# EAGLE schematic KVR LABS - AEV ENCODER 1.01-STM32 (EAGLE 9.6.1)

## Sheet 1 of 9: STM32F413RGT6
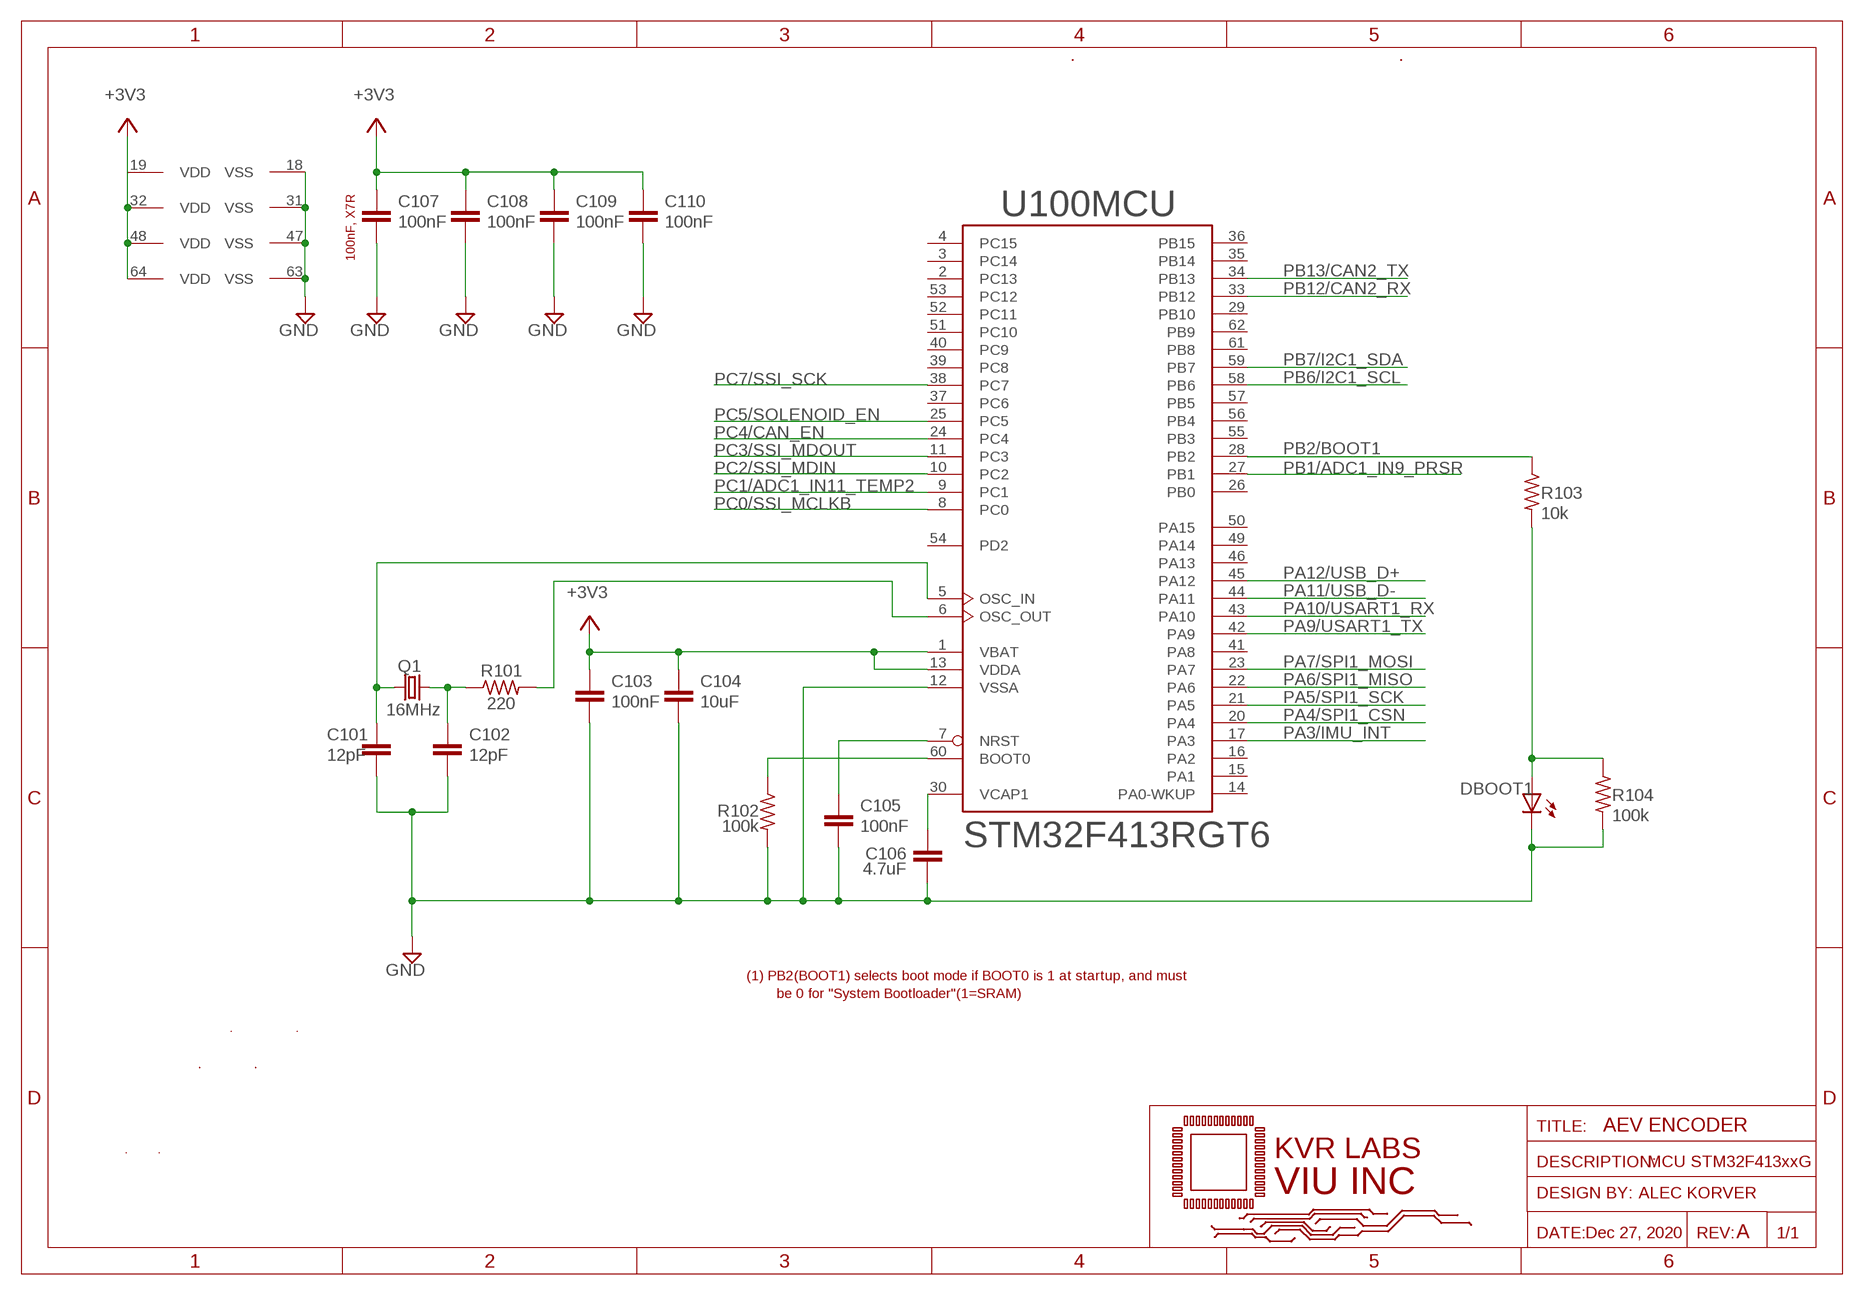
[diagram p0: schematic, sheet 1]

### Parts
C101  12pF  C-EUC0603  [C0603]
C102  12pF  C-EUC0603  [C0603]
C103  100nF  C-EUC0603  [C0603]
C104  10uF  C-EUC0603  [C0603]
C105  100nF  C-EUC0603  [C0603]
C106  4.7uF  C-EUC0603  [C0603]
C107  100nF  C-EUC0603  [C0603]
C108  100nF  C-EUC0603  [C0603]
C109  100nF  C-EUC0603  [C0603]
C110  100nF  C-EUC0603  [C0603]
DBOOT1  LEDCHIPLED_0805  [CHIPLED_0805]
Q1  16MHz  CRYTALS32  [CRY3225-4]
R101  220  R-US_R0603  [R0603]
R102  100k  R-US_R0603  [R0603]
R103  10k  R-US_R0603  [R0603]
R104  100k  R-US_R0603  [R0603]
U100  STM32F413RGT6  STM32F401RBT  [LQFP64_STMLIB]

### Nets
+3V3: C103.1 C104.1 C107.1 C108.1 C109.1 C110.1 U100.1(MCU:VBAT) U100.13(MCU:VDDA) U100.19(PWR:VDD) U100.32(PWR:VDD) U100.48(PWR:VDD) U100.64(PWR:VDD) ; also sheet 2,4,5,6,7,8
BOOT0: R102.1 U100.60(MCU:BOOT0) ; also sheet 7
GND: C101.2 C102.2 C103.2 C104.2 C105.2 C106.2 C107.2 C108.2 C109.2 C110.2 DBOOT1.C R102.2 R104.2 U100.12(MCU:VSSA) U100.18(PWR:VSS) U100.31(PWR:VSS) U100.47(PWR:VSS) U100.63(PWR:VSS) ; also sheet 2,4,5,6,7,8,9
N$43: DBOOT1.A R103.2 R104.1
N$44: R101.2 U100.6(MCU:OSC_OUT)
NRST: C105.1 U100.7(MCU:NRST)
OSC_IN: C101.1 Q1.3 U100.5(MCU:OSC_IN)
OSC_OUT: C102.1 Q1.1 R101.1
PA3/IMU_INT: U100.17(MCU:PA3) ; also sheet 5
PA4/SPI1_CSN: U100.20(MCU:PA4) ; also sheet 5
PA5/SPI1_SCK: U100.21(MCU:PA5) ; also sheet 5
PA6/SPI1_MISO: U100.22(MCU:PA6) ; also sheet 5
PA7/SPI1_MOSI: U100.23(MCU:PA7) ; also sheet 5
PA9/USART1_TX: U100.42(MCU:PA9) ; also sheet 7
PA10/USART1_RX: U100.43(MCU:PA10) ; also sheet 7
PA11/USB_D- [power]: U100.44(MCU:PA11) ; also sheet 7
PA12/USB_D+ [power]: U100.45(MCU:PA12) ; also sheet 7
PB1/ADC1_IN9_PRSR: U100.27(MCU:PB1) ; also sheet 7
PB2/BOOT1: R103.1 U100.28(MCU:PB2) ; also sheet 7
PB6/I2C1_SCL: U100.58(MCU:PB6)
PB7/I2C1_SDA: U100.59(MCU:PB7)
PB12/CAN2_RX: U100.33(MCU:PB12) ; also sheet 2
PB13/CAN2_TX: U100.34(MCU:PB13) ; also sheet 2
PC0/SSI_MCLKB: U100.8(MCU:PC0) ; also sheet 4
PC1/ADC1_IN11_TEMP2: U100.9(MCU:PC1) ; also sheet 8
PC2/SSI_MDIN: U100.10(MCU:PC2) ; also sheet 4
PC3/SSI_MDOUT: U100.11(MCU:PC3) ; also sheet 4
PC4/CAN_EN: U100.24(MCU:PC4) ; also sheet 2
PC5/SOLENOID_EN: U100.25(MCU:PC5) ; also sheet 9
PC7/SSI_SCK: U100.38(MCU:PC7) ; also sheet 4
VCAP: C106.1 U100.30(MCU:VCAP1)
Unconnected: U100.2(MCU:PC13) U100.3(MCU:PC14) U100.4(MCU:PC15) U100.14(MCU:PA0-WKUP) U100.15(MCU:PA1) U100.16(MCU:PA2) U100.26(MCU:PB0) U100.29(MCU:PB10) U100.35(MCU:PB14) U100.36(MCU:PB15) U100.37(MCU:PC6) U100.39(MCU:PC8) U100.40(MCU:PC9) U100.41(MCU:PA8) U100.46(MCU:PA13) U100.49(MCU:PA14) U100.50(MCU:PA15) U100.51(MCU:PC10) U100.52(MCU:PC11) U100.53(MCU:PC12) U100.54(MCU:PD2) U100.55(MCU:PB3) U100.56(MCU:PB4) U100.57(MCU:PB5) U100.61(MCU:PB8) U100.62(MCU:PB9)

### Notes on the sheet
- 100nF, X7R
- (1) PB2(BOOT1) selects boot mode if BOOT0 is 1 at startup, and must
- be 0 for "System Bootloader"(1=SRAM)
- AEV ENCODER
- MCU STM32F413xxG
- Dec 27, 2020 | A

## Sheet 2 of 9: CANbus
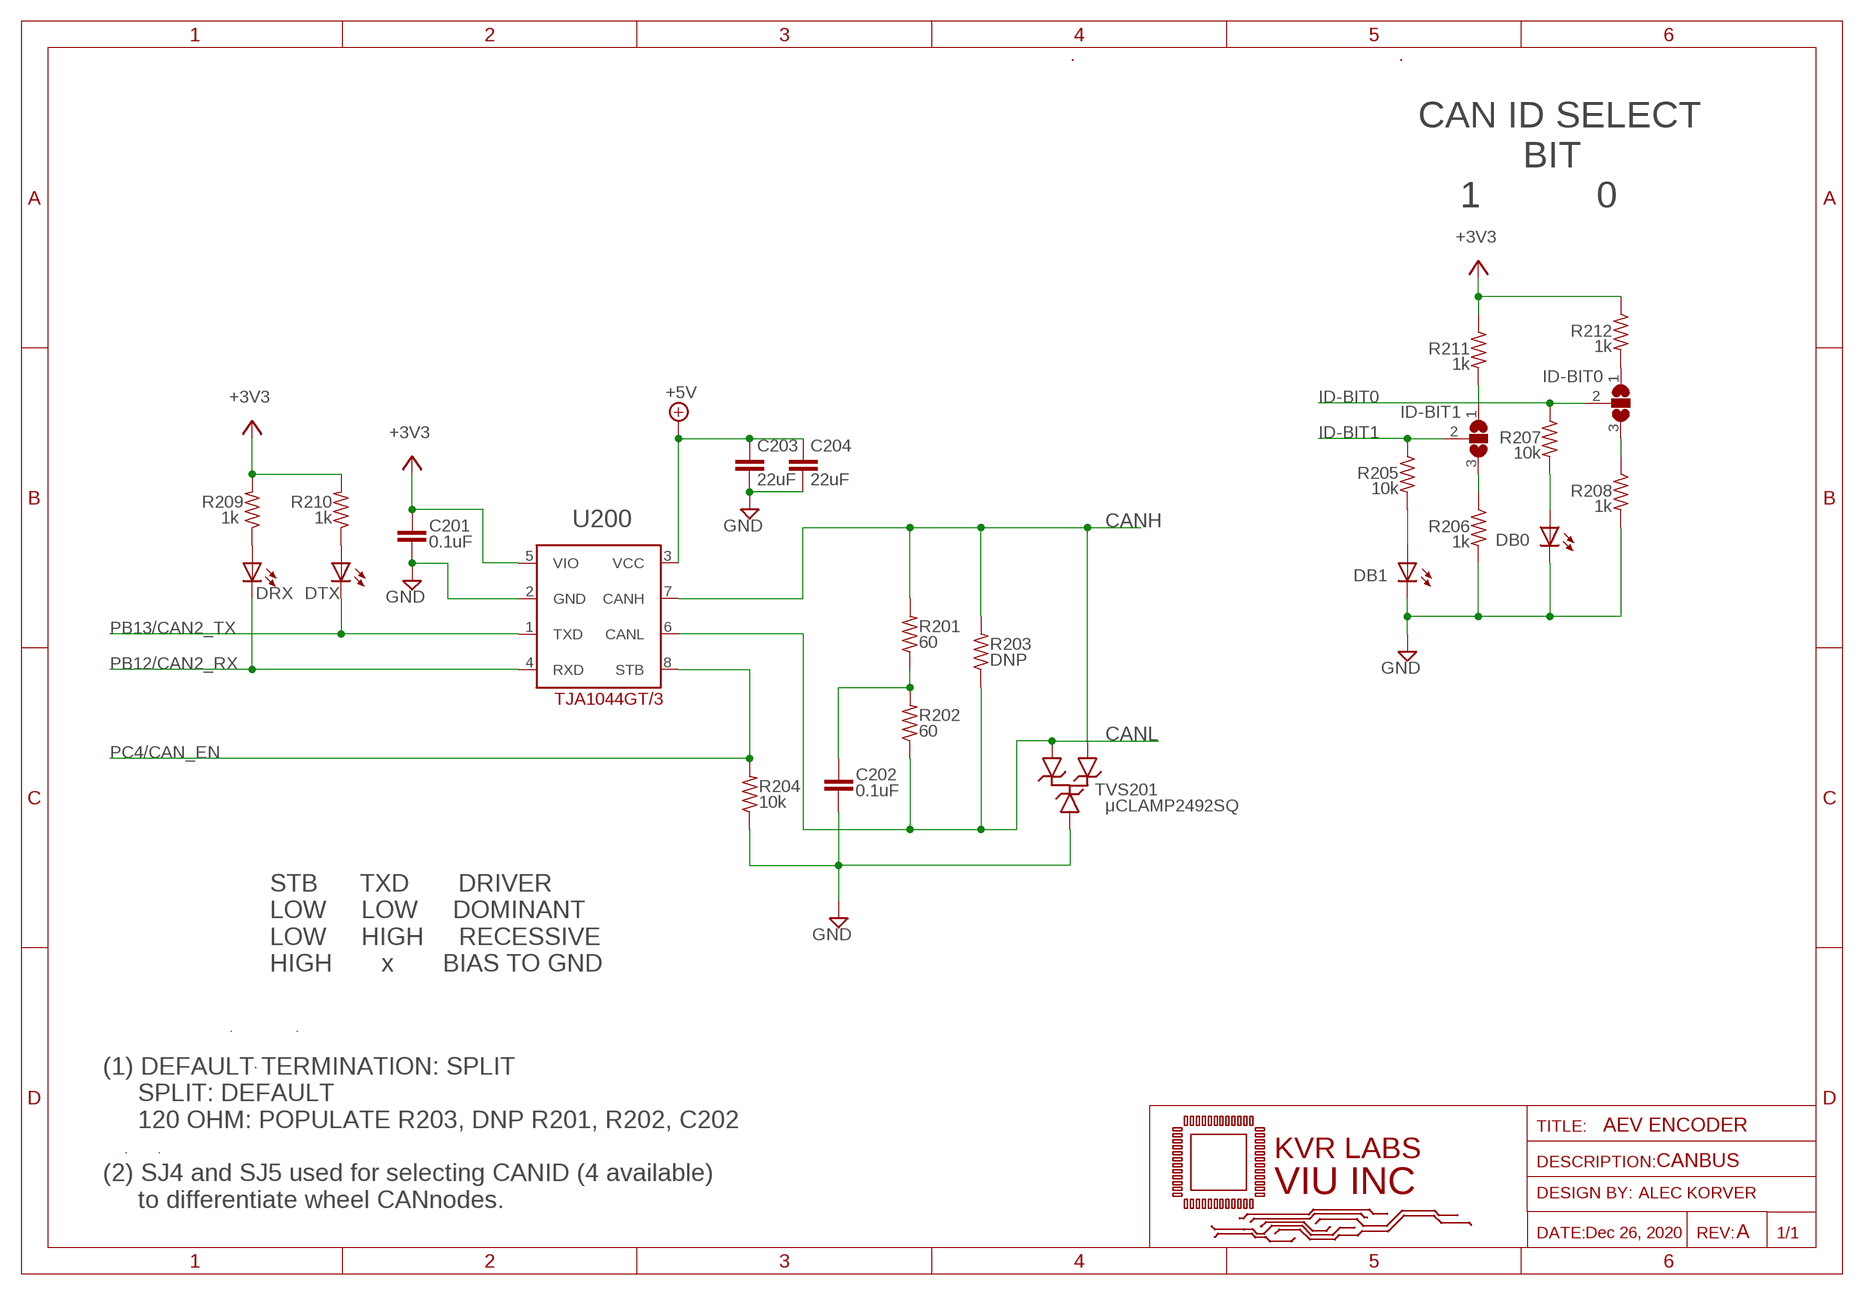
[diagram p1: schematic, sheet 2]

### Parts
C201  0.1uF  C-EUC0603  [C0603]
C202  0.1uF  C-EUC0603  [C0603]
C203  22uF  C-EUC1206  [C1206]
C204  22uF  C-EUC1206  [C1206]
D201  μCLAMP2492SQ  [SOT-23_3L_ONS]
DB0  LEDCHIPLED_0805  [CHIPLED_0805]
DB1  LEDCHIPLED_0805  [CHIPLED_0805]
DRX  LEDCHIPLED_0805  [CHIPLED_0805]
DTX  LEDCHIPLED_0805  [CHIPLED_0805]
ID-BIT0  SJ2W  [SJ_2]
ID-BIT1  SJ2W  [SJ_2]
R201  60  R-US_R0603  [R0603]
R202  60  R-US_R0603  [R0603]
R203  DNP  R-US_R0603  [R0603]
R204  10k  R-US_R0603  [R0603]
R205  10k  R-US_R0603  [R0603]
R206  1k  R-US_R0603  [R0603]
R207  10k  R-US_R0603  [R0603]
R208  1k  R-US_R0603  [R0603]
R209  1k  R-US_R0603  [R0603]
R210  1k  R-US_R0603  [R0603]
R211  1k  R-US_R0603  [R0603]
R212  1k  R-US_R0603  [R0603]
U200  TJA1044GT/3  [SO-8_S_LIT]

### Nets
+3V3: C201.1 R209.2 R210.2 R211.1 R212.1 U200.5(VIO) ; also sheet 1,4,5,6,7,8
+5V: C203.1 C204.1 U200.3(VCC) ; also sheet 6
CANH: D201.2 R201.2 R203.2 U200.7(CANH) ; also sheet 7
CANL: D201.1 R202.1 R203.1 U200.6(CANL) ; also sheet 7
GND: C201.2 C202.2 C203.2 C204.2 D201.3 DB0.C DB1.C R204.1 R206.2 R208.2 U200.2(GND) ; also sheet 1,4,5,6,7,8,9
ID-BIT0: ID-BIT0.2 R207.1
ID-BIT1: ID-BIT1.2 R205.1
N$4: ID-BIT1.3 R206.1
N$6: ID-BIT0.3 R208.1
N$9: DB0.A R207.2
N$10: DB1.A R205.2
N$14: ID-BIT1.1 R211.2
N$15: ID-BIT0.1 R212.2
N$26: DRX.A R209.1
N$27: DTX.A R210.1
PB12/CAN2_RX: DRX.C U200.4(RXD) ; also sheet 1
PB13/CAN2_TX: DTX.C U200.1(TXD) ; also sheet 1
PC4/CAN_EN: R204.2 U200.8(STB) ; also sheet 1
SPLIT: C202.1 R201.1 R202.2

### Notes on the sheet
- CAN ID SELECT
             BIT
       1           0
- U200
- TVS201
- STB      TXD       DRIVER
  LOW     LOW     DOMINANT
  LOW     HIGH     RECESSIVE
  HIGH       x       BIAS TO GND
- AEV ENCODER
- CANBUS
- (1) DEFAULT TERMINATION: SPLIT
       SPLIT: DEFAULT 
       120 OHM: POPULATE R203, DNP R201, R202, C202
  
  (2) SJ4 and SJ5 used for selecting CANID (4 available) 
       to differentiate wheel CANnodes.
- Dec 26, 2020 | A

## Sheet 3 of 9: ABSOLUTE ENCODER
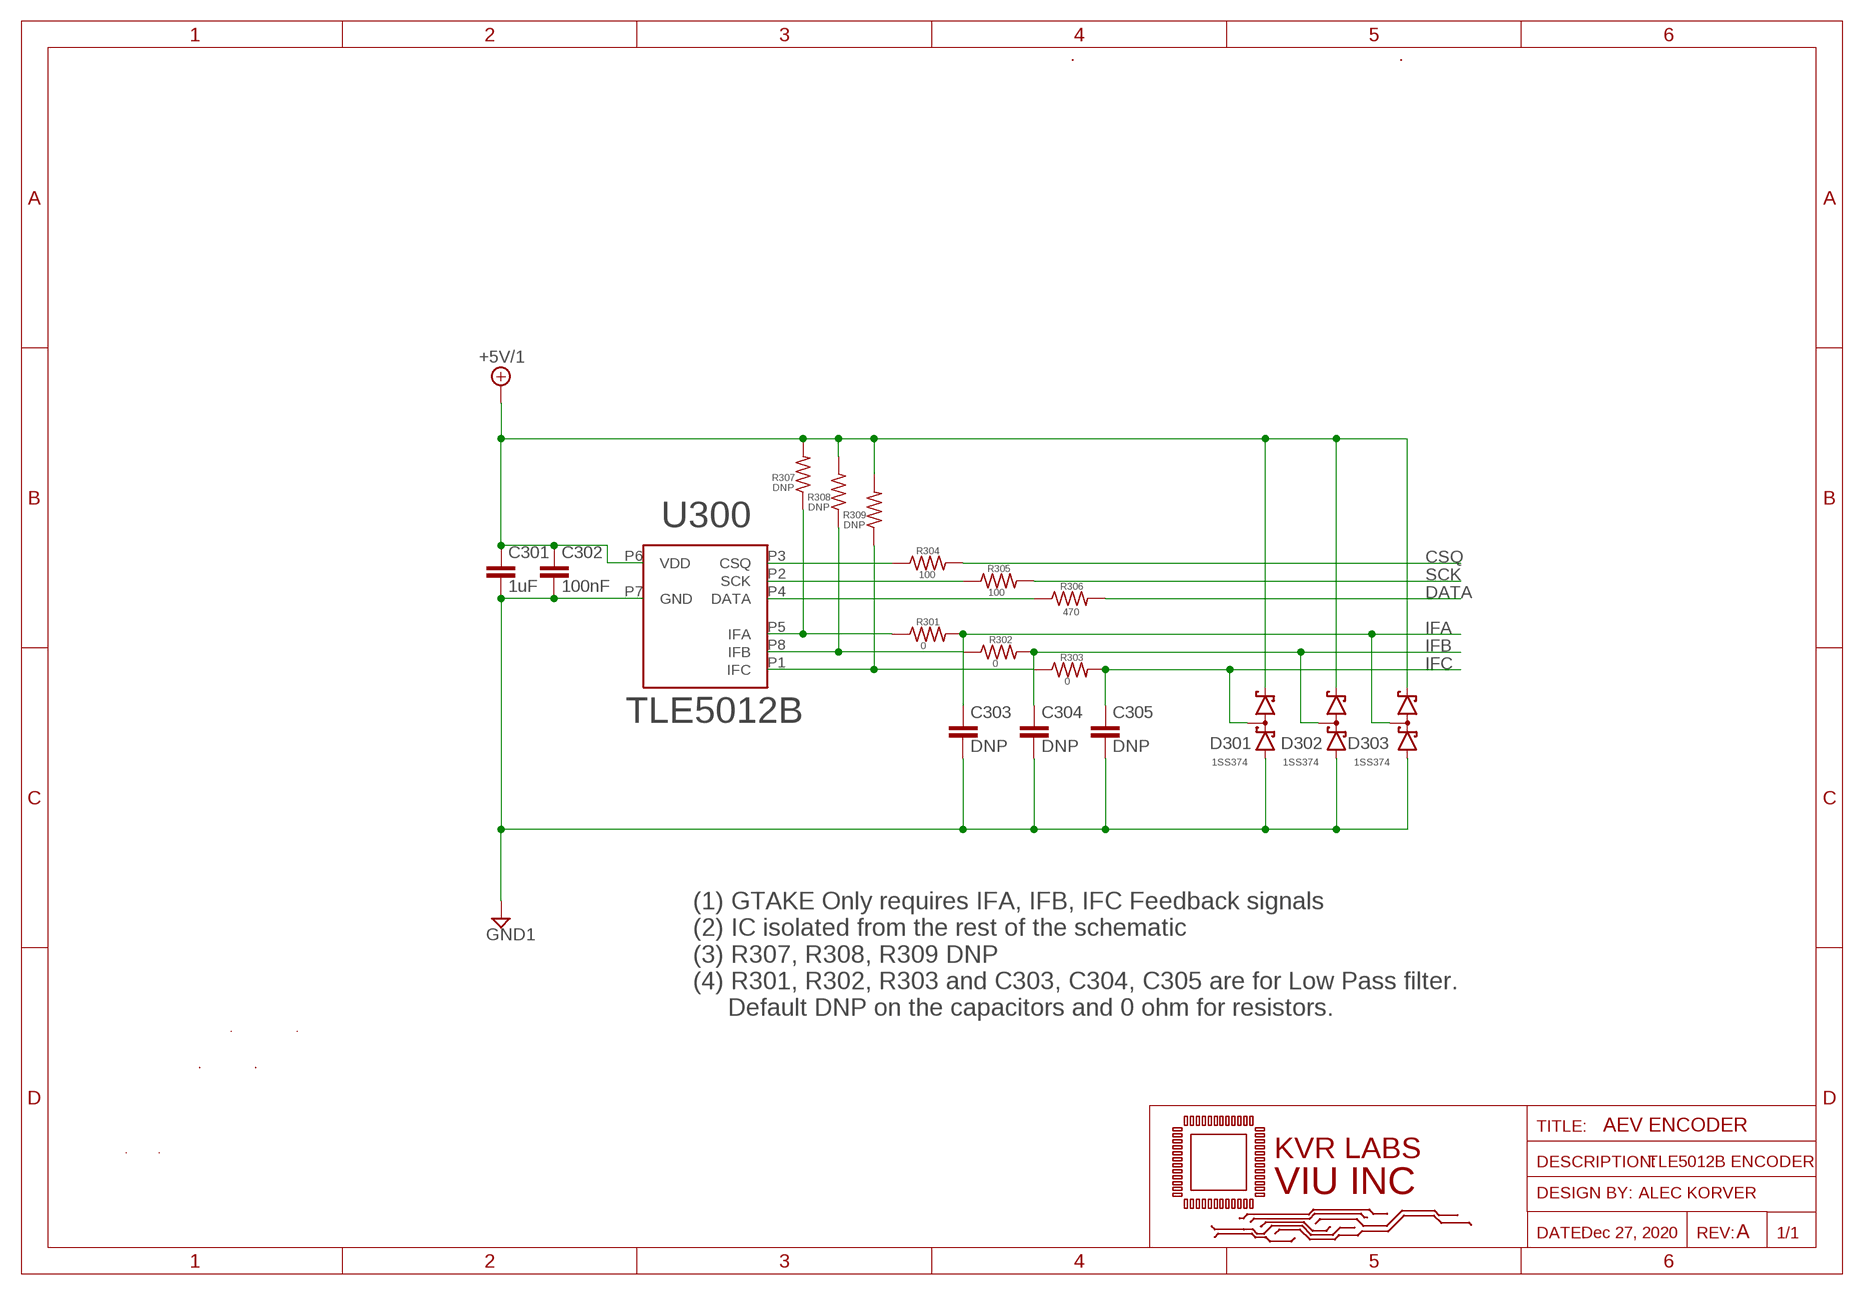
[diagram p2: schematic, sheet 3]

### Parts
C301  1uF  C-EUC0603  [C0603]
C302  100nF  C-EUC0603  [C0603]
C303  DNP  C-EUC0603  [C0603]
C304  DNP  C-EUC0603  [C0603]
C305  DNP  C-EUC0603  [C0603]
D301  BAS70-04  [SOT23]
D302  BAS70-04  [SOT23]
D303  BAS70-04  [SOT23]
R301  0  R-US_R0603  [R0603]
R302  0  R-US_R0603  [R0603]
R303  0  R-US_R0603  [R0603]
R304  100  R-US_R0603  [R0603]
R305  100  R-US_R0603  [R0603]
R306  470  R-US_R0603  [R0603]
R307  DNP  R-US_R0603  [R0603]
R308  DNP  R-US_R0603  [R0603]
R309  DNP  R-US_R0603  [R0603]
U300  TLE5012B  [PG-DSO-8]

### Nets
+5V/1: C301.1 C302.1 D301.2(C2) D302.2(C2) D303.2(C2) R307.2 R308.2 R309.2 U300.P6(VDD) ; also sheet 7
CSQ: R304.2 ; also sheet 7
DATA: R306.2 ; also sheet 7
GND1: C301.2 C302.2 C303.2 C304.2 C305.2 D301.1(A1) D302.1(A1) D303.1(A1) U300.P7(GND) ; also sheet 7
IFA: C303.1 D303.3(C1A2) R301.2 ; also sheet 7
IFB: C304.1 D302.3(C1A2) R302.2 ; also sheet 7
IFC: C305.1 D301.3(C1A2) R303.2 ; also sheet 7
N$35: R304.1 U300.P3(CSQ)
N$36: R305.1 U300.P2(SCK)
N$37: R306.1 U300.P4(DATA)
N$38: R301.1 R307.1 U300.P5(IFA)
N$39: R302.1 R308.1 U300.P8(IFB)
N$40: R303.1 R309.1 U300.P1(IFC)
SCK: R305.2 ; also sheet 7

### Notes on the sheet
- U300
- (1) GTAKE Only requires IFA, IFB, IFC Feedback signals
  (2) IC isolated from the rest of the schematic
  (3) R307, R308, R309 DNP 
  (4) R301, R302, R303 and C303, C304, C305 are for Low Pass filter. 
       Default DNP on the capacitors and 0 ohm for resistors.
- AEV ENCODER
- TLE5012B ENCODER
- Dec 27, 2020 | A

## Sheet 4 of 9: PRESSURE SENSOR
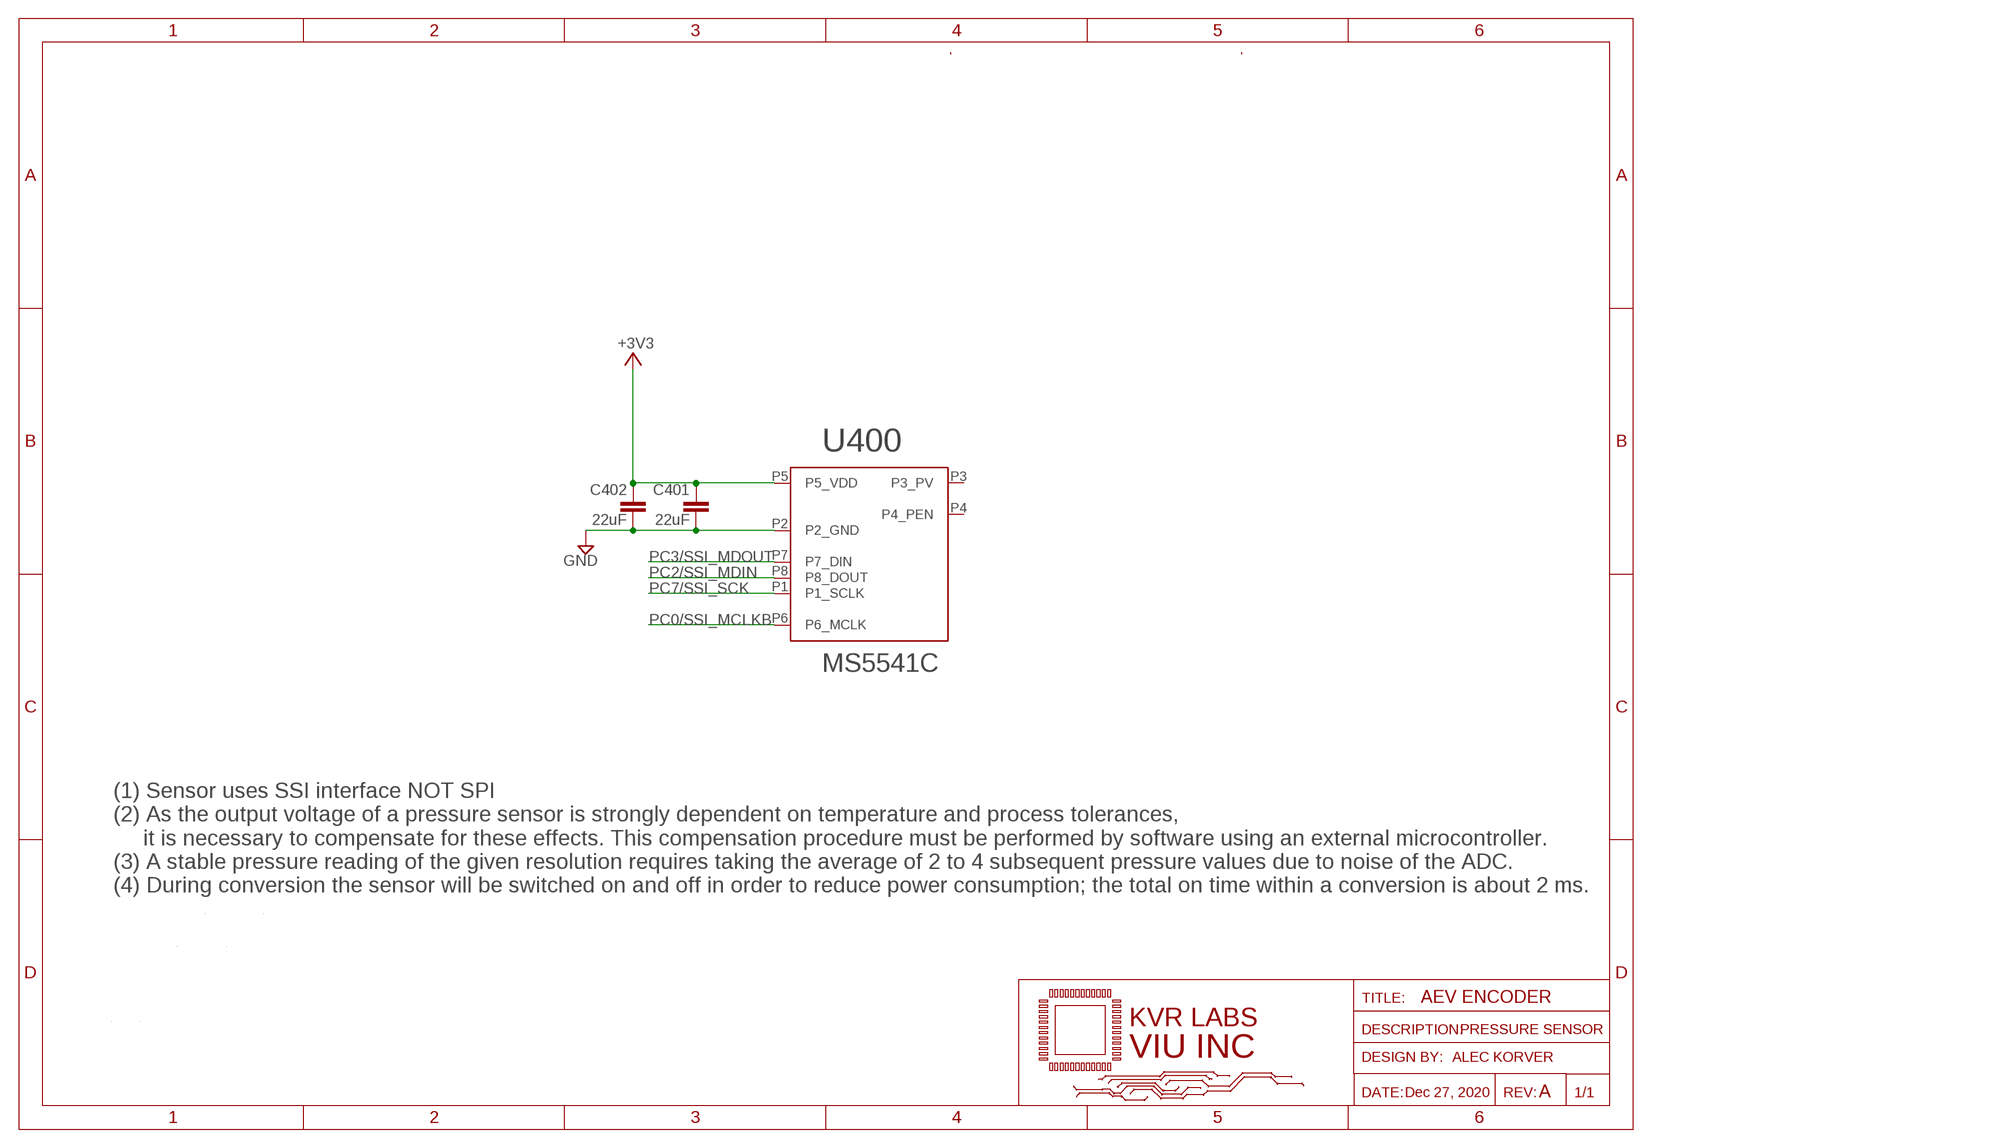
[diagram p3: schematic, sheet 4]

### Parts
C401  22uF  C-EUC1206  [C1206]
C402  22uF  C-EUC1206  [C1206]
U400  MS5541C  [MS5541C]

### Nets
+3V3: C401.1 C402.1 U400.P5(P5_VDD) ; also sheet 1,2,5,6,7,8
GND: C401.2 C402.2 U400.P2(P2_GND) ; also sheet 1,2,5,6,7,8,9
PC0/SSI_MCLKB: U400.P6(P6_MCLK) ; also sheet 1
PC2/SSI_MDIN: U400.P8(P8_DOUT) ; also sheet 1
PC3/SSI_MDOUT: U400.P7(P7_DIN) ; also sheet 1
PC7/SSI_SCK: U400.P1(P1_SCLK) ; also sheet 1
Unconnected: U400.P3(P3_PV) U400.P4(P4_PEN)

### Notes on the sheet
- (1) Sensor uses SSI interface NOT SPI
  (2) As the output voltage of a pressure sensor is strongly dependent on temperature and process tolerances, 
       it is necessary to compensate for these effects. This compensation procedure must be performed by software using an external microcontroller. 
  (3) A stable pressure reading of the given resolution requires taking the average of 2 to 4 subsequent pressure values due to noise of the ADC. 
  (4) During conversion the sensor will be switched on and off in order to reduce power consumption; the total on time within a conversion is about 2 ms.
- AEV ENCODER
- PRESSURE SENSOR
- Dec 27, 2020 | A

## Sheet 5 of 9: IMU - ICM20648
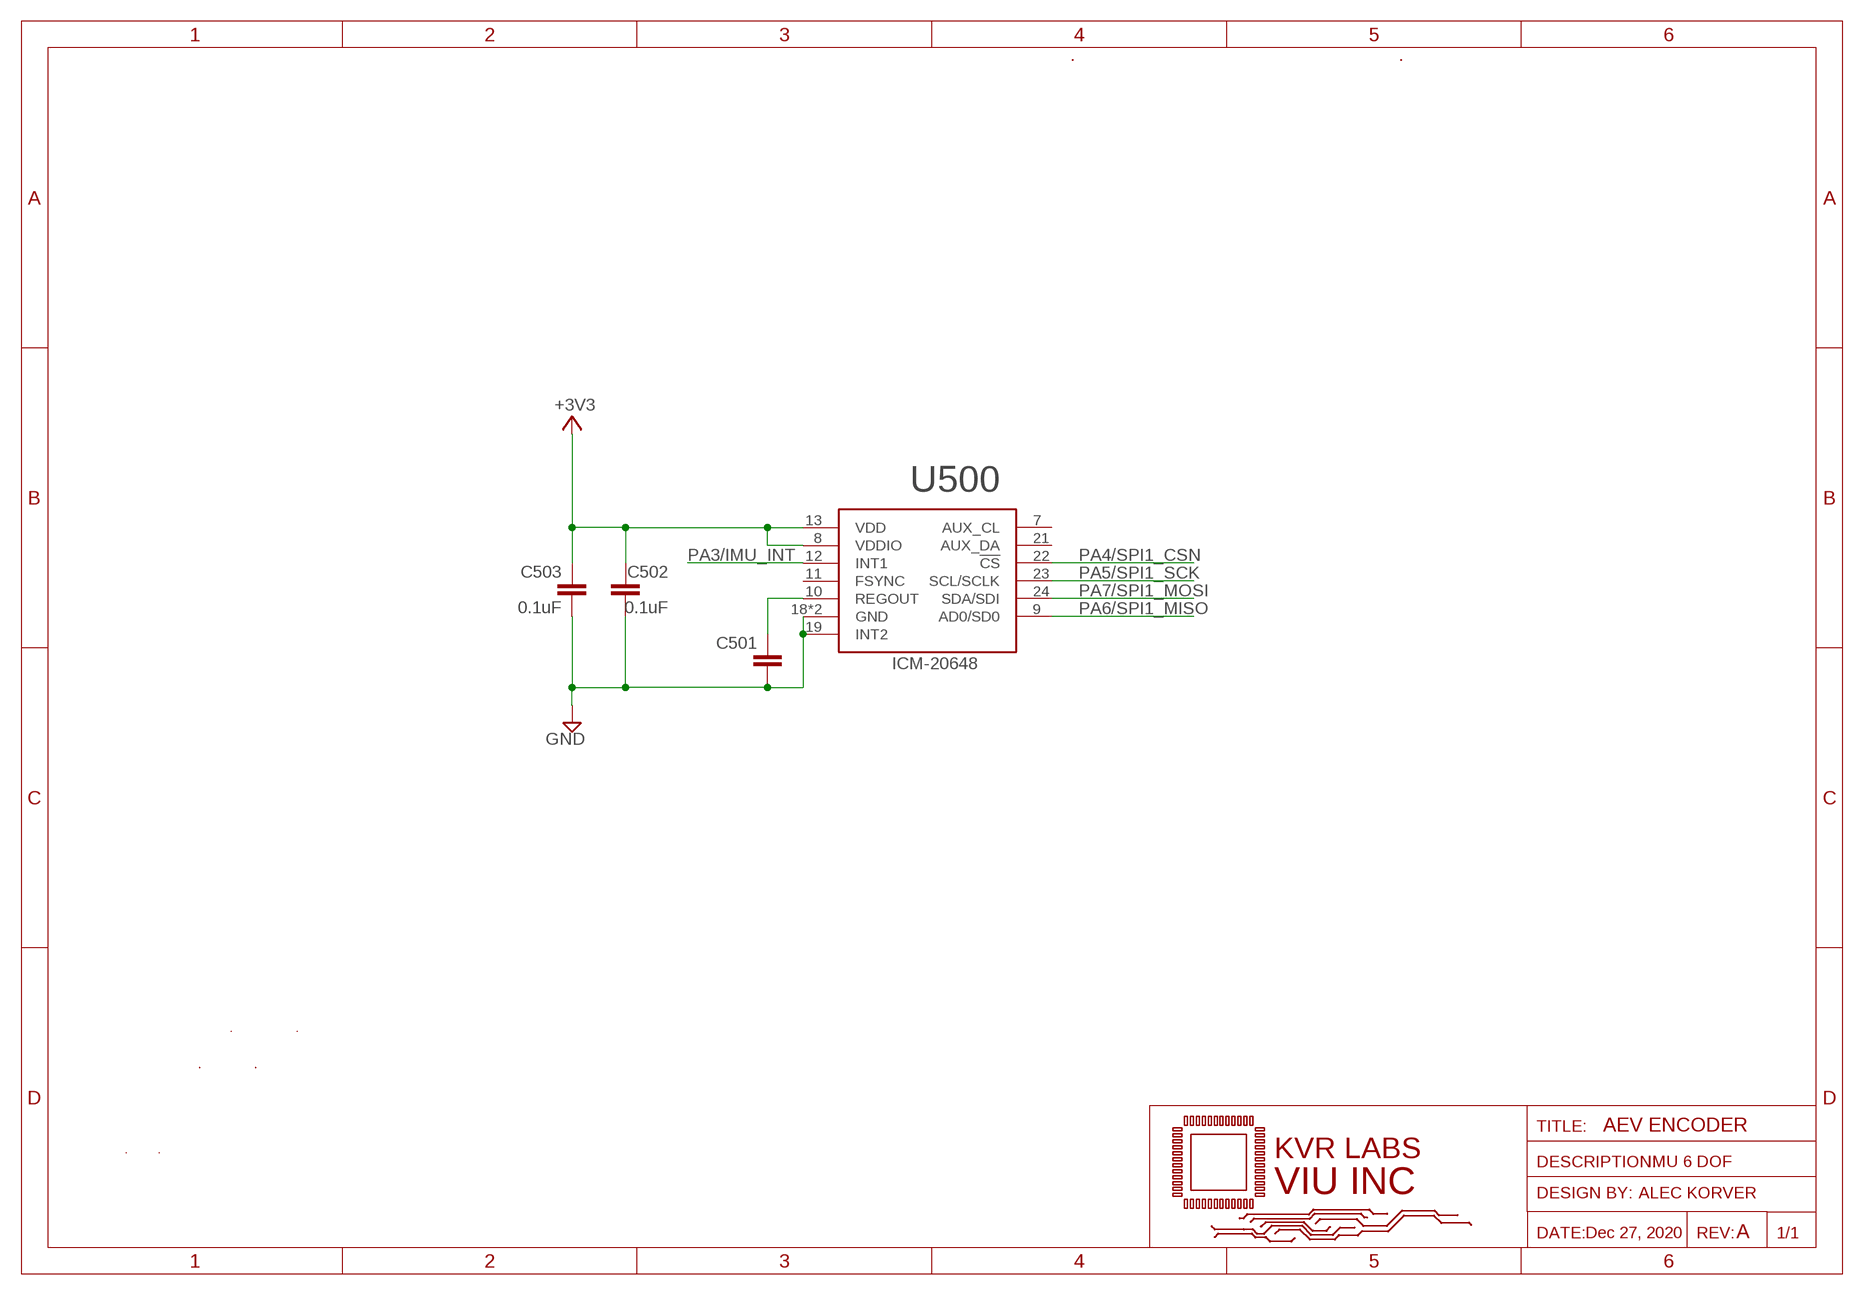
[diagram p4: schematic, sheet 5]

### Parts
C501  0.1uF  C-EUC0603  [C0603]
C502  0.1uF  C-EUC0603  [C0603]
C503  0.1uF  C-EUC0603  [C0603]
U500  ICM-20648  [ICM-20648]

### Nets
+3V3: C502.1 C503.1 U500.8(VDDIO) U500.13(VDD) ; also sheet 1,2,4,6,7,8
GND: C501.2 C502.2 C503.2 U500.18(GND) U500.19(INT2) U500.20(GND) ; also sheet 1,2,4,6,7,8,9
PA3/IMU_INT: U500.12(INT1) ; also sheet 1
PA4/SPI1_CSN: U500.22(!CS) ; also sheet 1
PA5/SPI1_SCK: U500.23(SCL/SCLK) ; also sheet 1
PA6/SPI1_MISO: U500.9(AD0/SD0) ; also sheet 1
PA7/SPI1_MOSI: U500.24(SDA/SDI) ; also sheet 1
REGOUT2: C501.1 U500.10(REGOUT)
Unconnected: U500.7(AUX_CL) U500.11(FSYNC) U500.21(AUX_DA)

### Notes on the sheet
- AEV ENCODER
- IMU 6 DOF
- Dec 27, 2020 | A

## Sheet 6 of 9: Voltage Regulators
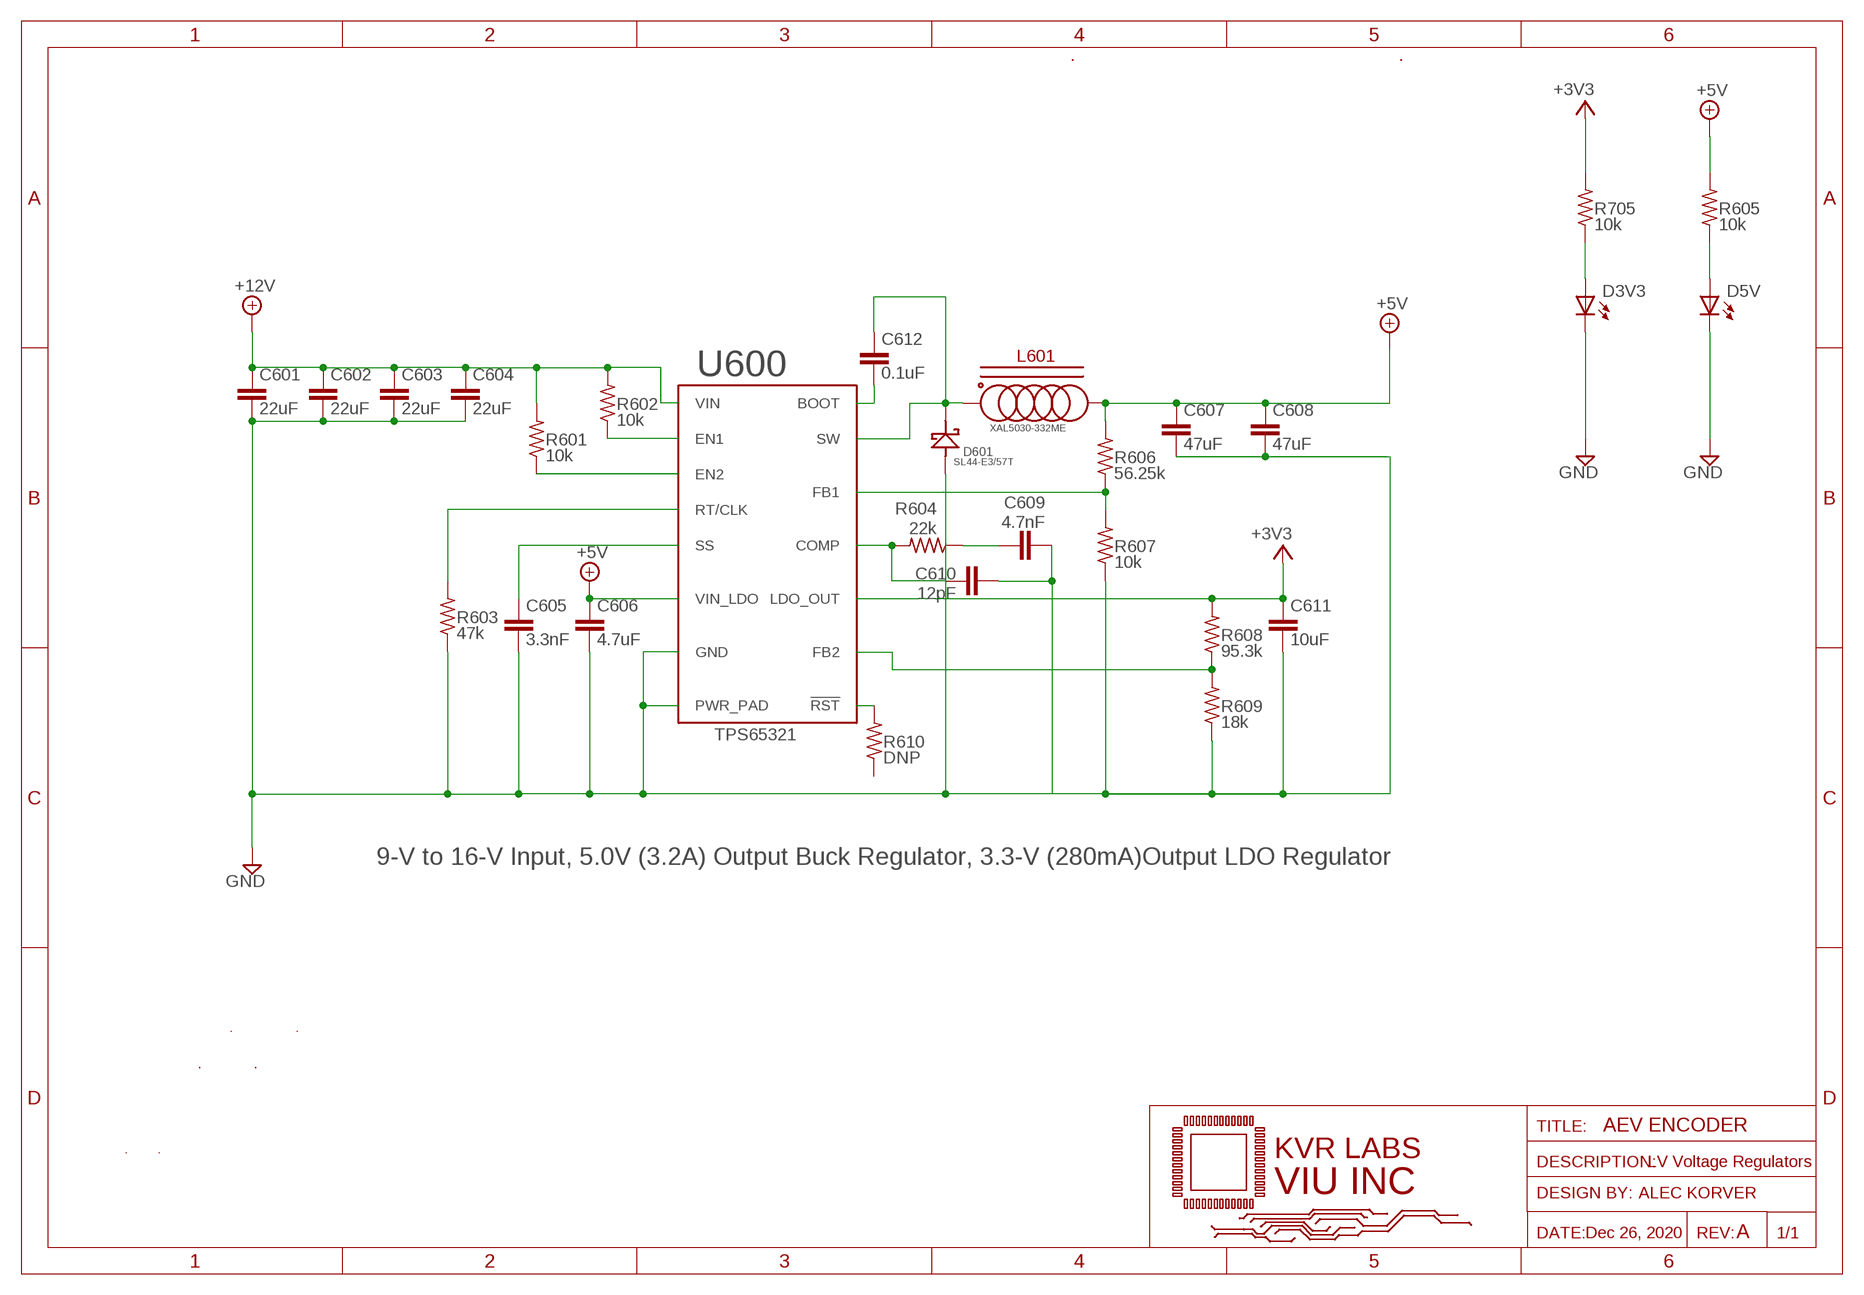
[diagram p5: schematic, sheet 6]

### Parts
C601  22uF  C-EUC0603  [C0603]
C602  22uF  C-EUC0603  [C0603]
C603  22uF  C-EUC0603  [C0603]
C604  22uF  C-EUC0603  [C0603]
C605  3.3nF  C-EUC0603  [C0603]
C606  4.7uF  C-EUC0603  [C0603]
C607  47uF  C-EUC1210  [C1210]
C608  47uF  C-EUC1210  [C1210]
C609  4.7nF  C-EUC0603  [C0603]
C610  12pF  C-EUC0603  [C0603]
C611  10uF  C-EUC0603  [C0603]
C612  0.1uF  C-EUC0603  [C0603]
D3V3  LEDCHIPLED_0805  [CHIPLED_0805]
D5V  LEDCHIPLED_0805  [CHIPLED_0805]
D601  SL44  [DO-214AB]
L601  XAL5030  [XAL5030]
R601  10k  R-US_R0603  [R0603]
R602  10k  R-US_R0603  [R0603]
R603  47k  R-US_R0603  [R0603]
R604  22k  R-US_R0603  [R0603]
R605  10k  R-US_R0603  [R0603]
R606  56.25k  R-US_R0603  [R0603]
R607  10k  R-US_R0603  [R0603]
R608  95.3k  R-US_R0603  [R0603]
R609  18k  R-US_R0603  [R0603]
R610  DNP  R-US_R0603  [R0603]
R705  10k  R-US_R0603  [R0603]
U600  TPS65321-Q1  [14-HTSSOP]

### Nets
+3V3: C611.1 R608.2 R705.2 U600.P4(LDO_OUT) ; also sheet 1,2,4,5,7,8
+5V: C606.1 C607.1 C608.1 L601.P2 R605.2 R606.2 U600.P3(VIN_LDO) ; also sheet 2
+12V: C601.1 C602.1 C603.1 C604.1 R601.2 R602.2 U600.P2(VIN) ; also sheet 7,9
BOOT: C612.2 U600.P1(BOOT)
COMP: C610.1 R604.2 U600.P12(COMP)
EN1: R602.1 U600.P8(EN1)
EN2: R601.1 U600.P7(EN2)
FB1: R606.1 R607.2 U600.P11(FB1)
FB2: R608.1 R609.2 U600.P5(FB2)
GND: C601.2 C602.2 C603.2 C604.2 C605.2 C606.2 C607.2 C608.2 C609.2 C610.2 C611.2 D3V3.C D5V.C D601.ANODE R603.1 R607.1 R609.1 U600.P13(GND) U600.P15(PWR_PAD) U600.P16(PWR_PAD) U600.P17(PWR_PAD) U600.P18(PWR_PAD) U600.P19(PWR_PAD) U600.P20(PWR_PAD) U600.P21(PWR_PAD) U600.P22(PWR_PAD) U600.P23(PWR_PAD) ; also sheet 1,2,4,5,7,8,9
N$2: D3V3.A R705.1
N$22: D5V.A R605.1
N$41: C609.1 R604.1
N$47: R610.2 U600.P6(!RST)
RT/CLK: R603.2 U600.P9(RT/CLK)
SS: C605.1 U600.P10(SS)
SW: C612.1 D601.CATHODE L601.P1 U600.P14(SW)
Unconnected: R610.1

### Notes on the sheet
- 9-V to 16-V Input, 5.0V (3.2A) Output Buck Regulator, 3.3-V (280mA)Output LDO Regulator
- AEV ENCODER
- LV Voltage Regulators
- Dec 26, 2020 | A

## Sheet 7 of 9: External Connectors
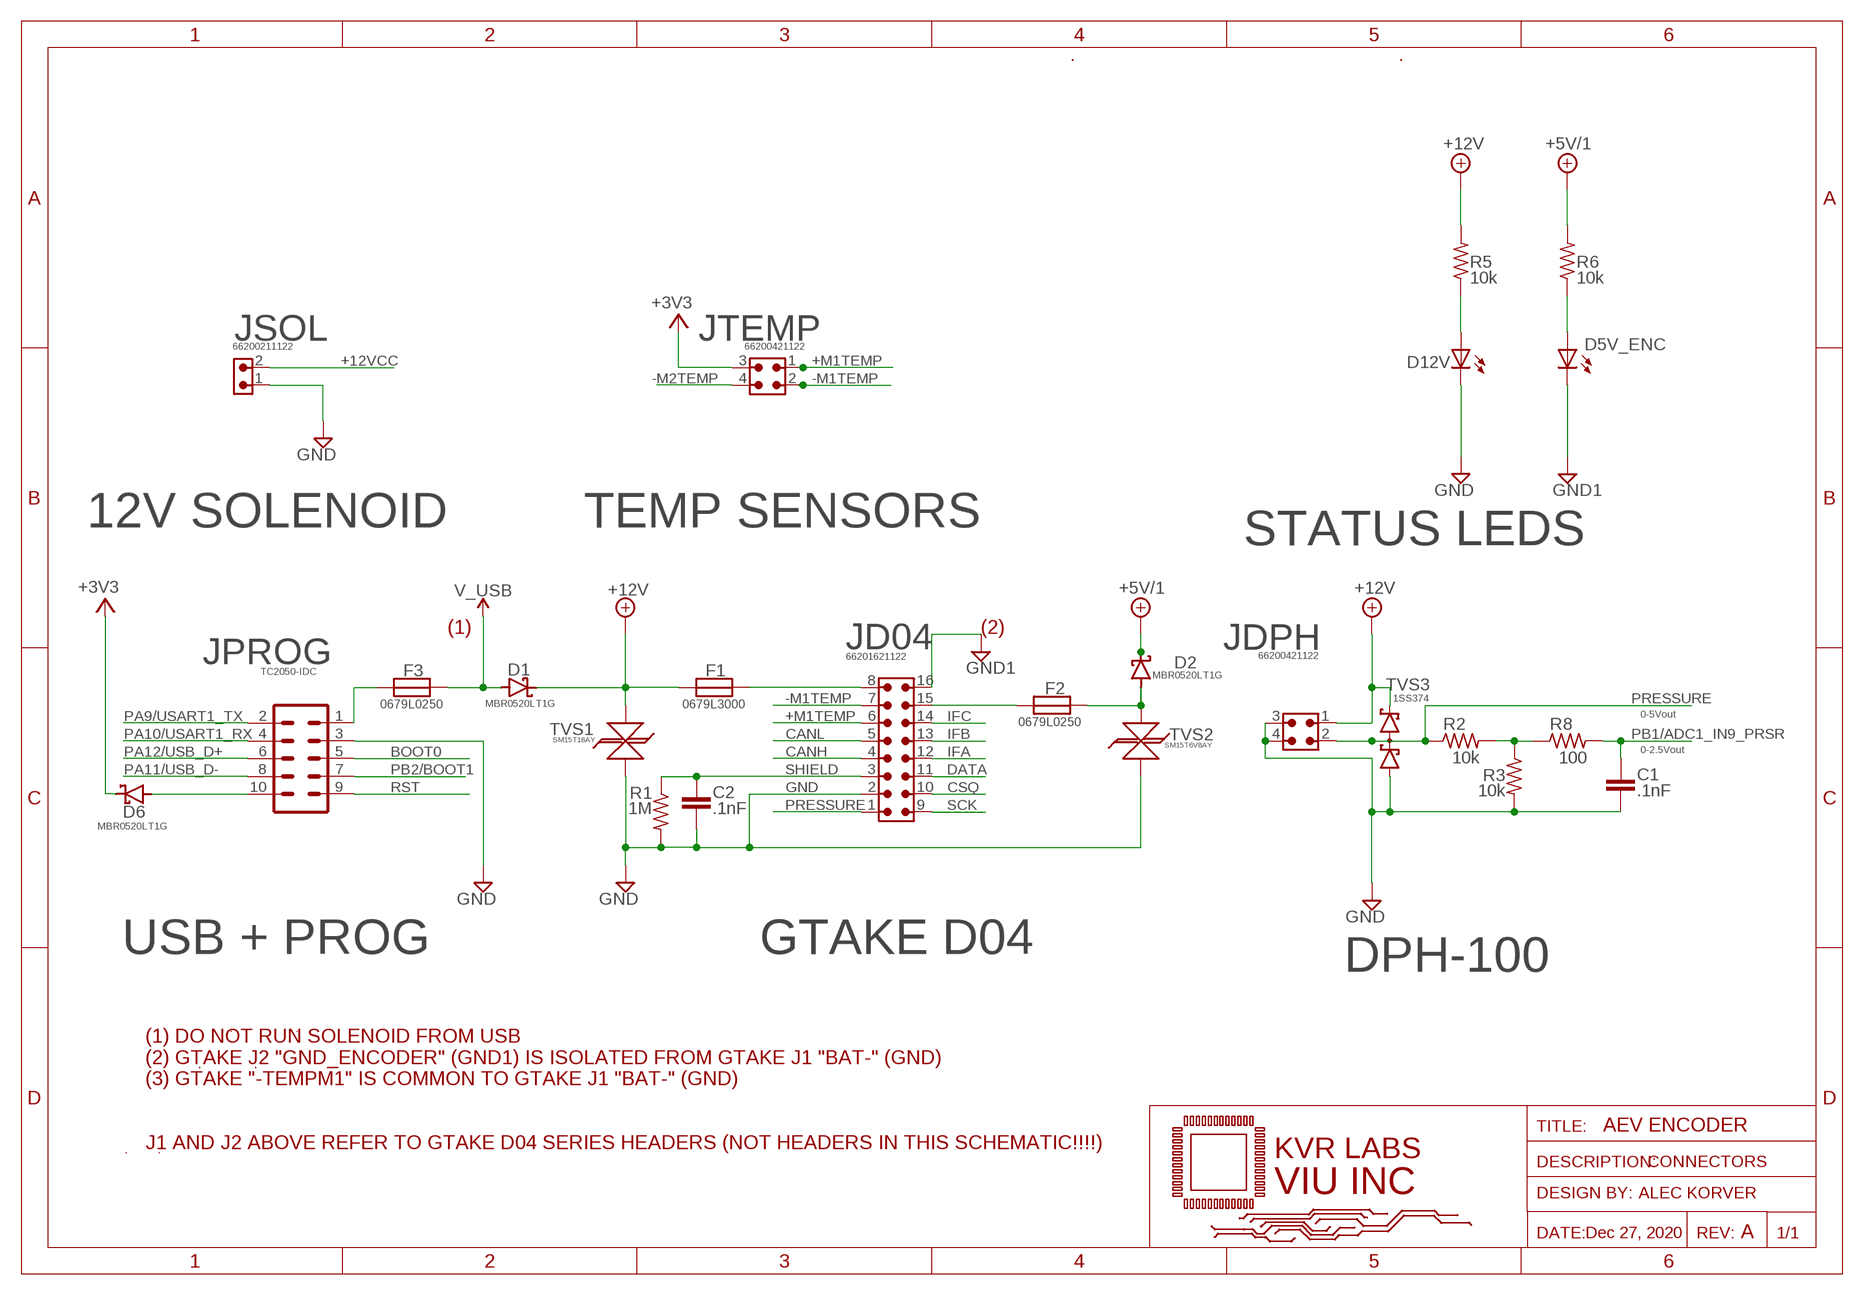
[diagram p6: schematic, sheet 7]

### Parts
C1  .1nF  C-EUC0603  [C0603]
C2  .1nF  C-EUC0603  [C0603]
D1  MBR0520LT1G  SCHOTTKY_MBR0520LT1GDO-219  [SODFL3718X115]
D2  MBR0520LT1G  SCHOTTKY_MBR0520LT1GDO-219  [SODFL3718X115]
D5V_ENC  LEDCHIPLED_0805  [CHIPLED_0805]
D6  MBR0520LT1G  SCHOTTKY_MBR0520LT1GDO-219  [SODFL3718X115]
D12V  LEDCHIPLED_0805  [CHIPLED_0805]
F1  0679L3000  0679L-FUSE  [2410(6125METRIC)]
F2  0679L0250  0679L-FUSE  [2410(6125METRIC)]
F3  0679L0250  0679L-FUSE  [2410(6125METRIC)]
JD04  6620XX21122_66201621122  [66201621122]
JDPH  6620XX21122_66200421122  [66200421122]
JPROG  TC2050-IDC  [TC2050-IDC]
JSOL  6620XX11122_66200211122  [66200211122]
JTEMP  6620XX21122_66200421122  [66200421122]
R1  1M  R-US_R0603  [R0603]
R2  10k  R-US_R0603  [R0603]
R3  10k  R-US_R0603  [R0603]
R5  10k  R-US_R0603  [R0603]
R6  10k  R-US_R0603  [R0603]
R8  100  R-US_R0603  [R0603]
TVS1  SM15T18AY  SM15TY  [SMC]
TVS2  SM15T6V8AY  SM15TY  [SMC]
TVS3  BAS70-04  [SOT23]

### Nets
+3V3: D6.1(C) JTEMP.3 ; also sheet 1,2,4,5,6,8
+5V/1: D2.1(C) R6.2 ; also sheet 3
+12V: D1.1(C) F1.P1 JDPH.1 R5.2 TVS1.P$2 TVS3.2(C2) ; also sheet 6,9
+12VCC: JSOL.2 ; also sheet 9
+M1TEMP: JD04.6 JTEMP.1
-M1TEMP: JD04.7 JTEMP.2
-M2TEMP: JTEMP.4 ; also sheet 8
BOOT0: JPROG.5 ; also sheet 1
CANH: JD04.4 ; also sheet 2
CANL: JD04.5 ; also sheet 2
CSQ: JD04.10 ; also sheet 3
DATA: JD04.11 ; also sheet 3
GND: C1.2 C2.2 D12V.C JD04.2 JDPH.3 JDPH.4 JPROG.3 JSOL.1 R1.2 R3.2 TVS1.P$1 TVS2.P$1 TVS3.1(A1) ; also sheet 1,2,4,5,6,8,9
GND1: D5V_ENC.C JD04.16 ; also sheet 3
IFA: JD04.12 ; also sheet 3
IFB: JD04.13 ; also sheet 3
IFC: JD04.14 ; also sheet 3
N$3: F2.P1 JD04.15
N$7: D2.2(A) F2.P2 TVS2.P$2
N$8: F1.P2 JD04.8
N$13: D6.2(A) JPROG.10
N$24: F3.P1 JPROG.1
N$25: D12V.A R5.1
N$28: R2.2 R3.1 R8.1
N$29: D5V_ENC.A R6.1
PA9/USART1_TX: JPROG.2 ; also sheet 1
PA10/USART1_RX: JPROG.4 ; also sheet 1
PA11/USB_D- [power]: JPROG.8 ; also sheet 1
PA12/USB_D+ [power]: JPROG.6 ; also sheet 1
PB1/ADC1_IN9_PRSR: C1.1 R8.2 ; also sheet 1
PB2/BOOT1: JPROG.7 ; also sheet 1
PRESSURE: JD04.1 JDPH.2 R2.1 TVS3.3(C1A2)
RST: JPROG.9
SCK: JD04.9 ; also sheet 3
SHIELD: C2.1 JD04.3 R1.1
V_USB: D1.2(A) F3.P2

### Notes on the sheet
- 12V SOLENOID | TEMP SENSORS
- STATUS LEDS
- (1) | (2)
- 0-5Vout
- SM15T18AY
- SM15T6V8AY
- 0-2.5Vout
- USB + PROG | GTAKE D04
- DPH-100
- AEV ENCODER
- (1) DO NOT RUN SOLENOID FROM USB
  (2) GTAKE J2 "GND_ENCODER" (GND1) IS ISOLATED FROM GTAKE J1 "BAT-" (GND)
  (3) GTAKE "-TEMPM1" IS COMMON TO GTAKE J1 "BAT-" (GND) 
  
  
  J1 AND J2 ABOVE REFER TO GTAKE D04 SERIES HEADERS (NOT HEADERS IN THIS SCHEMATIC!!!!)
- CONNECTORS
- Dec 27, 2020 | A

## Sheet 8 of 9: TEMP SENSORS
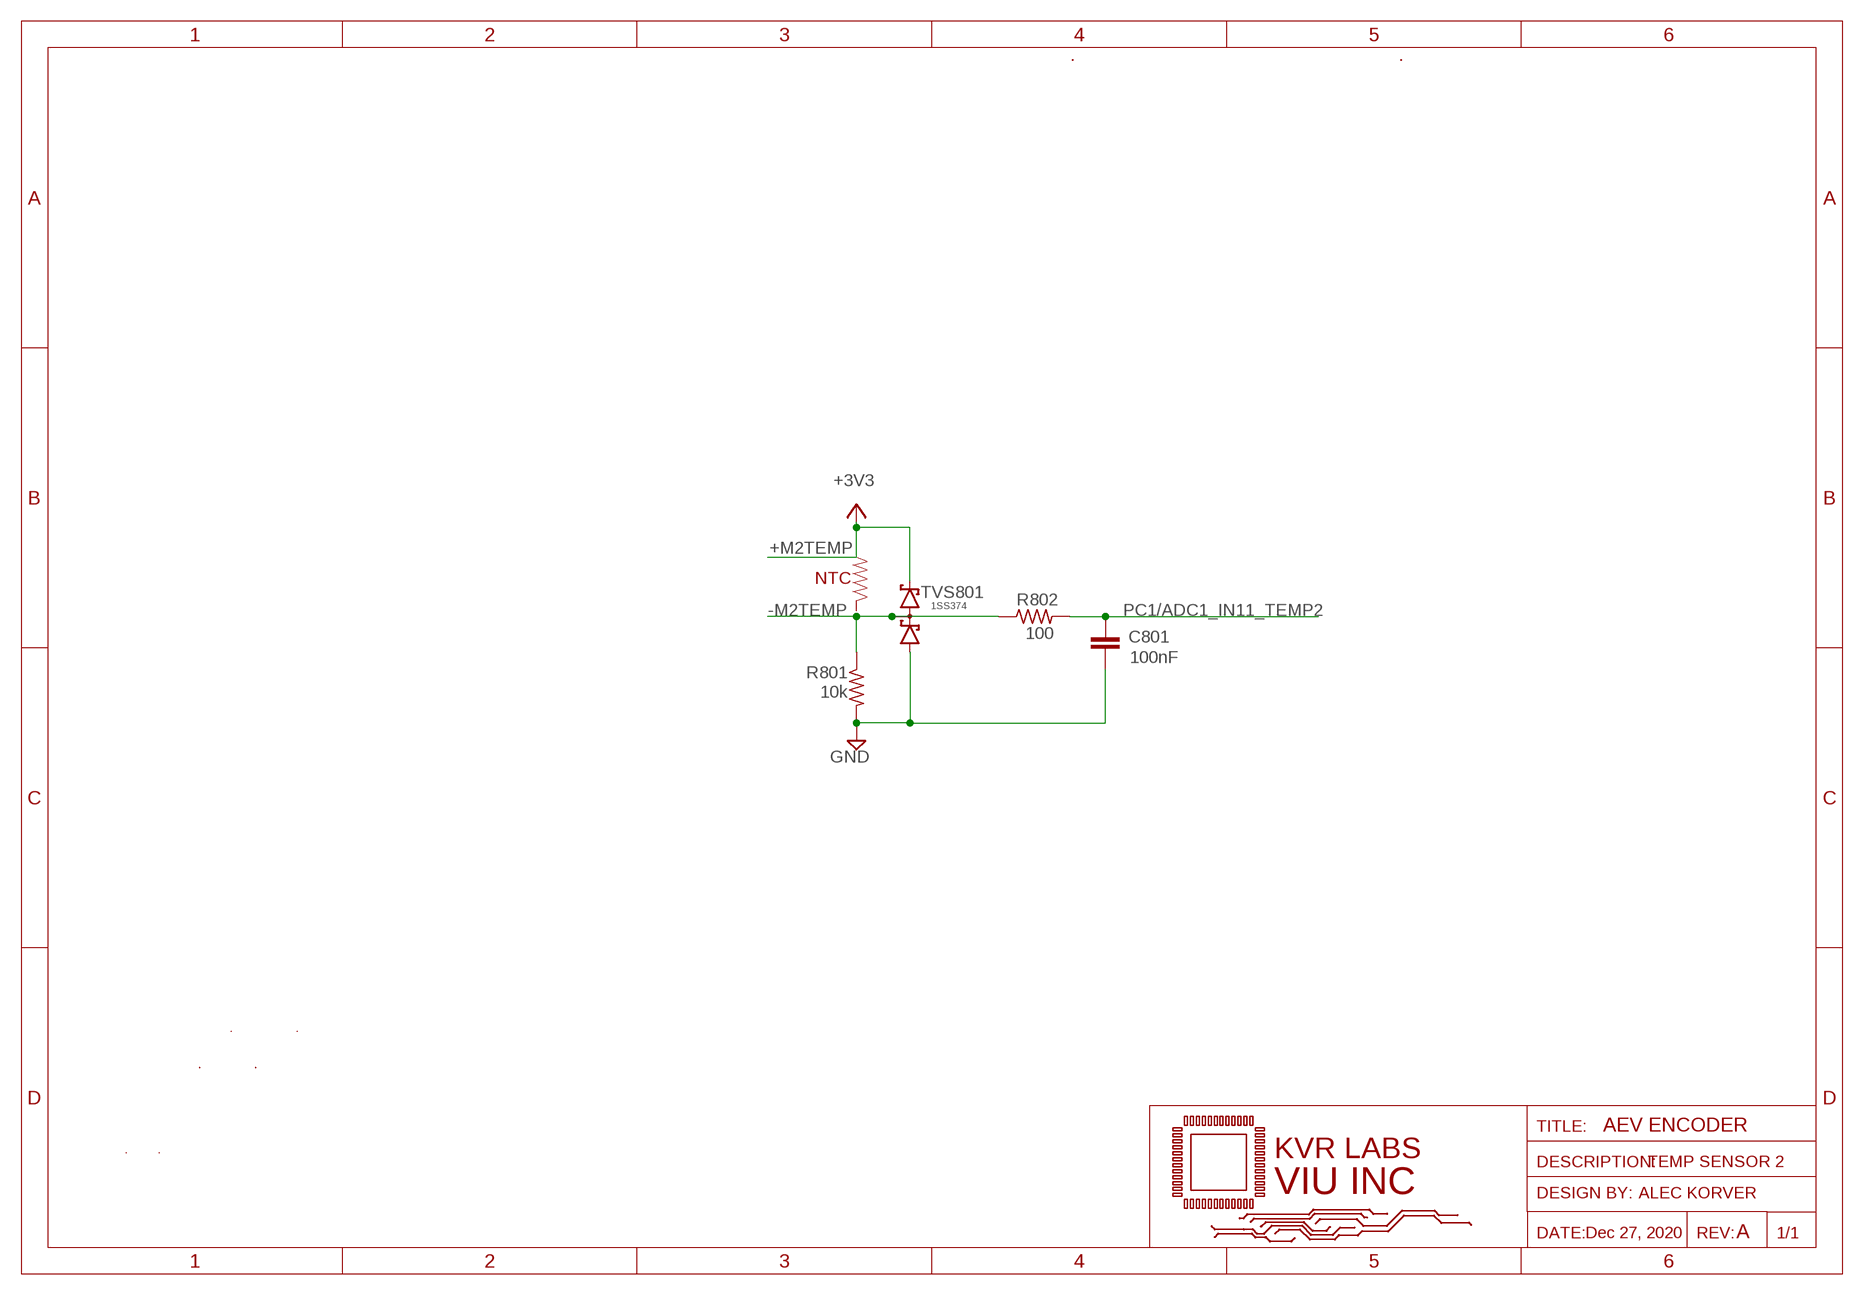
[diagram p7: schematic, sheet 8]

### Parts
C801  100nF  C-EUC0603  [C0603]
R801  10k  R-US_R0603  [R0603]
R802  100  R-US_R0603  [R0603]
TVS801  BAS70-04  [SOT23]

### Nets
+3V3: TVS801.2(C2) ; also sheet 1,2,4,5,6,7
-M2TEMP: R801.1 R802.1 TVS801.3(C1A2) ; also sheet 7
GND: C801.2 R801.2 TVS801.1(A1) ; also sheet 1,2,4,5,6,7,9
PC1/ADC1_IN11_TEMP2: C801.1 R802.2 ; also sheet 1

### Notes on the sheet
- +M2TEMP
- NTC
- AEV ENCODER
- TEMP SENSOR 2
- Dec 27, 2020 | A

## Sheet 9 of 9: 12V SOLENOID LOAD SWITCH
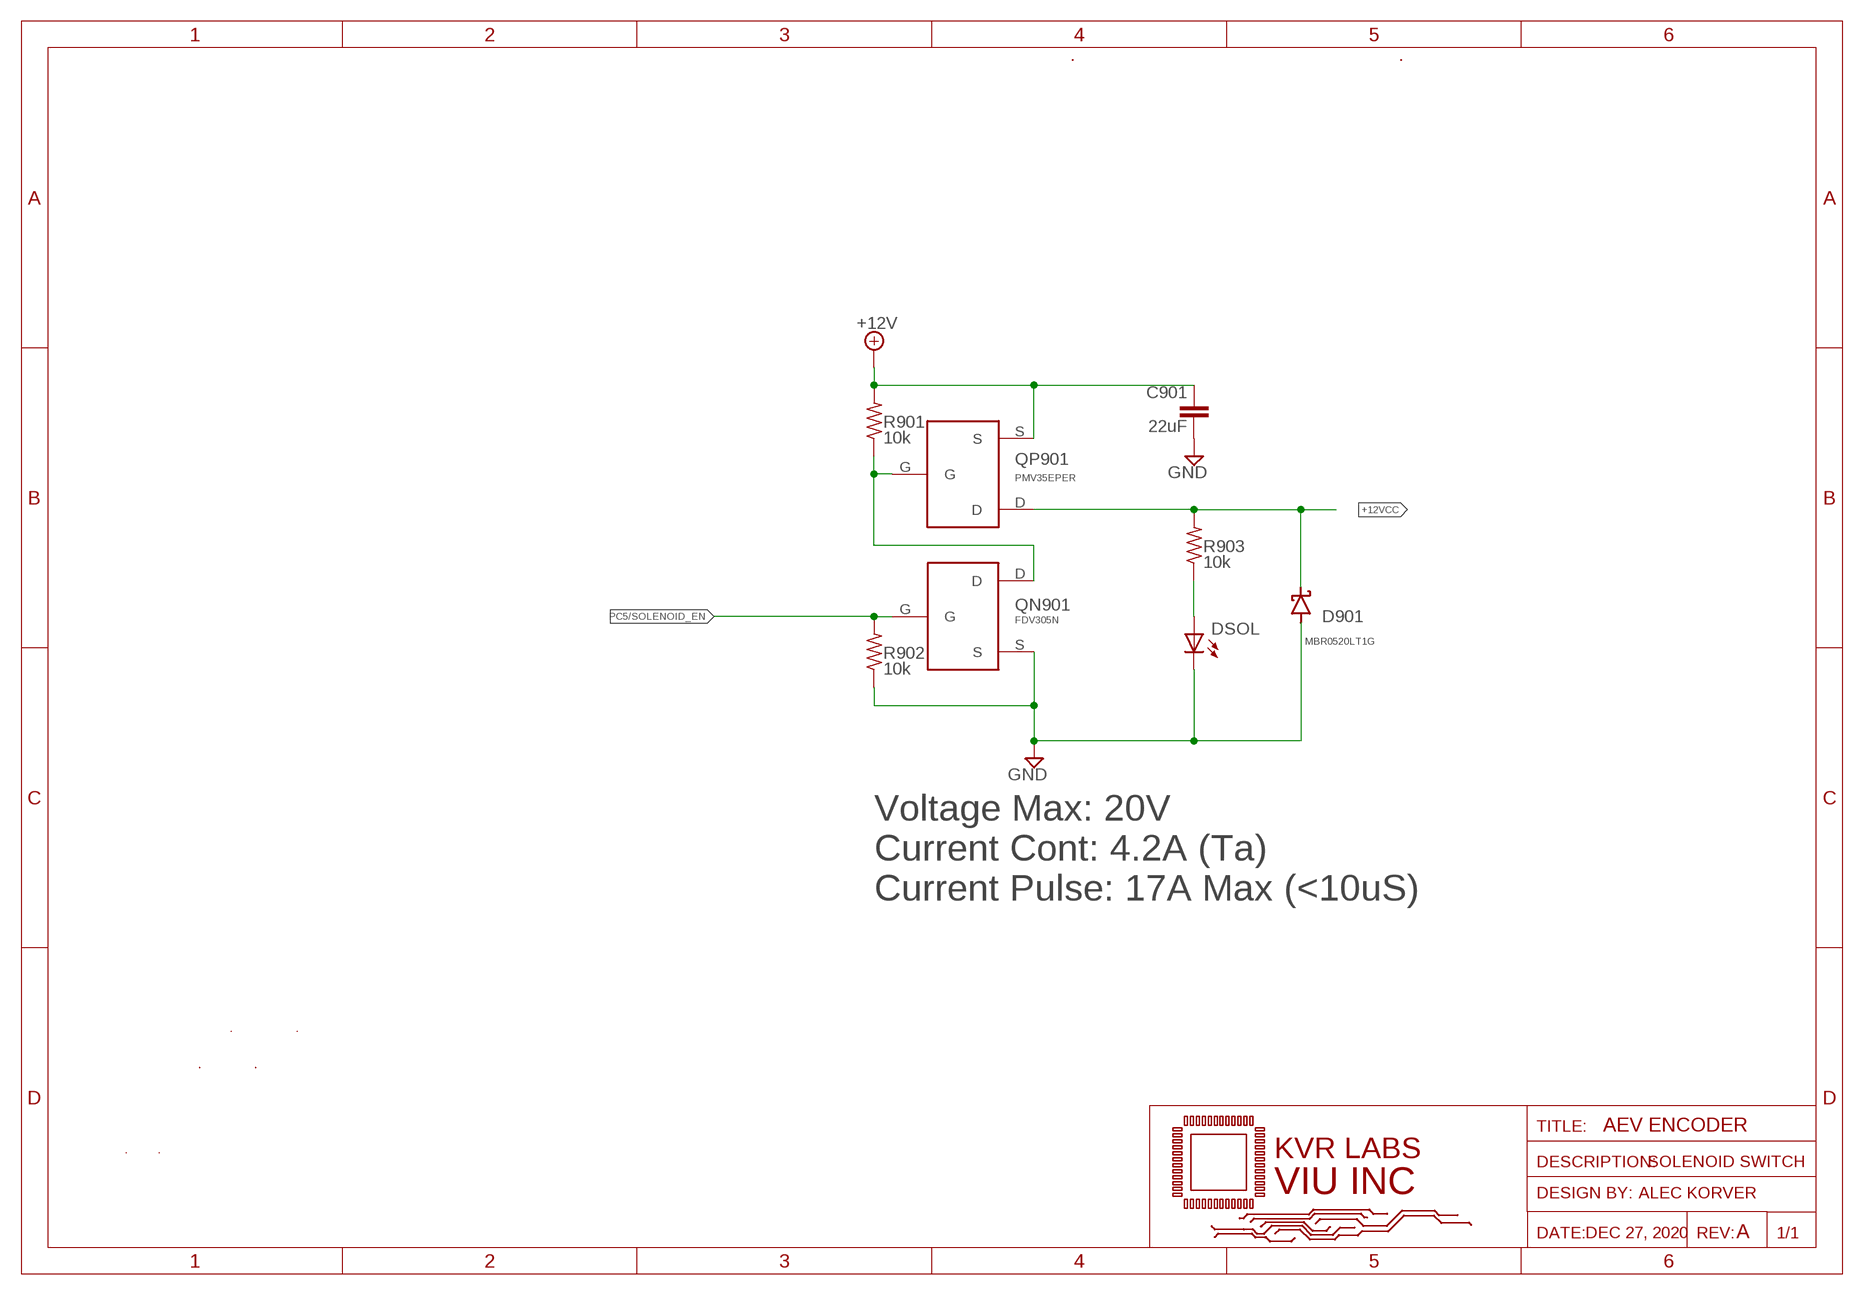
[diagram p8: schematic, sheet 9]

### Parts
C901  22uF  C-EUC1206  [C1206]
D901  MBR0520LT1G  SCHOTTKY_MBR0520LT1GDO-219  [SODFL3718X115]
DSOL  LEDCHIPLED_0805  [CHIPLED_0805]
QN901  FDV305N  NFET  [SOT323-3_NFET]
QP901  ZXM61P02FTA  NFET  [SOT323-3_NFET]
R901  10k  R-US_R0603  [R0603]
R902  10k  R-US_R0603  [R0603]
R903  10k  R-US_R0603  [R0603]

### Nets
+12V: C901.1 QP901.S R901.2 ; also sheet 6,7
+12VCC: D901.1(C) QP901.D R903.2 ; also sheet 7
GND: C901.2 D901.2(A) DSOL.C QN901.S R902.1 ; also sheet 1,2,4,5,6,7,8
N$1: QN901.D QP901.G R901.1
N$11: DSOL.A R903.1
PC5/SOLENOID_EN: QN901.G R902.2 ; also sheet 1

### Notes on the sheet
- QP901
- QN901
- Voltage Max: 20V 
  Current Cont: 4.2A (Ta) 
  Current Pulse: 17A Max (<10uS)
- AEV ENCODER
- SOLENOID SWITCH
- DEC 27, 2020 | A

## Library data of the parts
C1 C2 C101-C110 C201-C204 C301-C305 C401 C402 C501-C503 C601-C612 C801 C901 = rcl:C-EU: CAPACITOR, European symbol; SPICEPREFIX: C
D1 D2 D6 D901 = Diode:SCHOTTKY_: Schottky Diode - Popular parts; CATEGORY: Diode; DESCRIPTION: DIODE SCHOTTKY 20V 500MA SOD123; MANUFACTURER: ON Semiconductor; MODEL: MBR0520LT1G; MPN: MBR0520LT1G; SUB-CATEGORY: Schottky
D3V3 D5V D5V_ENC D12V DB0 DB1 DBOOT1 DRX DSOL DTX = adafruit:LED: LED OSRAM: - CHIPLED LG R971, LG N971, LY N971, LG Q971, LY Q971, LO R971, LY R971 LH N974, LH R974 LS Q976, LO Q976, LY Q976 LO Q996 - Hyper CHIPLED LW Q18S LB Q993, LB Q99A, LB R99A - SideLED LS A670, LO A670, LY A670, LG A670, LP A670 LB A673, LV A673, LT A673, LW A673 LH A674 LY A675 LS A676, LA A676, LO A676, LY A676, LW A676 LS A679, LY A679, LG A679 - Hyper Micro SIDELED® LS Y876, LA Y876, LO Y876, LY Y876 LT Y87S - SmartLED LW L88C, LW L88S LB L89C, LB L89S, LG L890 LS L89K, LO L89K, LY L89K LS L896, LA L896, LO L896, LY L896 - TOPLED LS T670, LO T670, LY T670, LG T670, LP T670 LSG T670, LSP T670, LSY T670, LOP T670, LYG T670 LG T671, LOG T671, LSG T671 LB T673, LV T673, LT T673, LW T673 LH T674 LS T676, LA T676, LO T676, LY T676, LB T676, LH T676, LSB T676, LW T676 LB T67C, LV T67C, LT T67C, LS T67K, LO T67K, LY T67K, LW E67C LS E67B, LA E67B, LO E67B, LY E67B, LB E67C, LV E67C, LT E67C LW T67C LS T679, LY T679, LG T679 LS T770, LO T770, LY T770, LG T770, LP T770 LB T773, LV T773, LT T773, LW T773 LH T774 LS E675, LA E675, LY E675, LS T675 LS T776, LA T776, LO T776, LY T776, LB T776 LHGB T686 LT T68C, LB T68C - Hyper Mini TOPLED® LB M676 - Mini TOPLED Santana® LG M470 LS M47K, LO M47K, LY M47K Source: http://www.osram.convergy.de/
D201 = PSFBC:μCLAMP2492SQ; MODEL: μCLAMP2492SQ
D301-D303 TVS3 TVS801 = diode:BAS70-04: Silicon Schottky Diodes General-purpose diode for high-speed switching; MODEL: 1SS374
D601 = PSFBC:SL44; DESCRIPTION: DIODE SCHOTTKY 40V 4A DO214AB; DIGIKEY: SL44-E3/57TGI; MODEL: SL44-E3/57T
F1 = PSFBC:0679L-FUSE; MODEL: 0679L3000
F2 F3 = PSFBC:0679L-FUSE; MODEL: 0679L0250
ID-BIT0 ID-BIT1 = jumper:SJ2W: SMD solder JUMPER
JD04 = Wurth_Connectors_WR-MPC3:6620XX21122_66201621122: WR-MPC3 3.00 mm Male Dual Row Vertical Header KIND PROPERTIES: Pitch:3 mm Gender:Male MATERIAL PROPERTIES: Insulator Material:LCP Insulator Flammability Rating:UL94 V-0 Insulator Color:Black Contact Material:Copper Alloy Contact Plating:Tin Contact Type:Stamped GENERAL INFORMATION Operating Temperature:-40 up to +105 °C Working Voltage:250V (AC) Withstanding Voltage:1500 V (AC) Contact Resistance:10 mΩ RISO:1000 MΩ CERTIFICATION UL Approval:E323964 PACKAGING PROPERTIES Packaging:Tube <https://katalog.we-online.com/media/images/v2/o33170v209%20Family_WR-MPC3_6620xx21122.jpg> Details see: https://katalog.we-online.com/en/em/MPC3_3_00_MALE_DUAL_ROW_VERTICAL_HEADER_6620XX21122 Updated by Yingchun,Shan 2019-11-13 2019 (C) Würth Elektronik; CONTACT-RESISTANCE: 10Ohm; DATASHEET-URL: https://katalog.we-online.com/em/datasheet/66201621122.pdf; GENDER: Male; IR1: 5A; L: 27.7mm; MATE-WITH: WR-MPC3 3.00 mm Female Dual Row Receptacle; MODEL: 66201621122; MOUNT: THT; PACKAGING: Tube; PART-NUMBER: 66201621122; PCB-CABLE-PANEL: PCB; PINS: 16; PITCH: 3mm; ROWS: Dual; TOL-R: max.; TYPE: Vertical; WORKING-VOLTAGE: 250V(AC)
JDPH JTEMP = Wurth_Connectors_WR-MPC3:6620XX21122_66200421122: WR-MPC3 3.00 mm Male Dual Row Vertical Header KIND PROPERTIES: Pitch:3 mm Gender:Male MATERIAL PROPERTIES: Insulator Material:LCP Insulator Flammability Rating:UL94 V-0 Insulator Color:Black Contact Material:Copper Alloy Contact Plating:Tin Contact Type:Stamped GENERAL INFORMATION Operating Temperature:-40 up to +105 °C Working Voltage:250V (AC) Withstanding Voltage:1500 V (AC) Contact Resistance:10 mΩ RISO:1000 MΩ CERTIFICATION UL Approval:E323964 PACKAGING PROPERTIES Packaging:Tube <https://katalog.we-online.com/media/images/v2/o33170v209%20Family_WR-MPC3_6620xx21122.jpg> Details see: https://katalog.we-online.com/en/em/MPC3_3_00_MALE_DUAL_ROW_VERTICAL_HEADER_6620XX21122 Updated by Yingchun,Shan 2019-11-13 2019 (C) Würth Elektronik; CONTACT-RESISTANCE: 10Ohm; DATASHEET-URL: https://katalog.we-online.com/em/datasheet/66200421122.pdf; GENDER: Male; IR1: 5A; L: 9.7mm; MATE-WITH: WR-MPC3 3.00 mm Female Dual Row Receptacle; MODEL: 66200421122; MOUNT: THT; PACKAGING: Tube; PART-NUMBER: 66200421122; PCB-CABLE-PANEL: PCB; PINS: 4; PITCH: 3mm; ROWS: Dual; TOL-R: max.; TYPE: Vertical; WORKING-VOLTAGE: 250V(AC)
JPROG = TagConnect:TC2050-IDC: Tag-Connect In Circuit Programming & Debug Cable 10 Pin http://www.tag-connect.com
JSOL = Wurth_Connectors_WR-MPC3:6620XX11122_66200211122: WR-MPC3 Single Row Male Vertical Header KIND PROPERTIES Pitch 3 mm Gender Male MATERIAL PROPERTIES Insulator Material LCP Insulator Flammability Rating UL94 V-0 Insulator Color Black Contact Material Copper Alloy Contact Plating Tin Contact Type Stamped GENERAL INFORMATION Operating Temperature -40 up to +105 °C Compliance:RoHS Working Voltage 250 V (AC) Withstanding Voltage 1500 V (AC) Contact Resistance 10 mΩ RISO 1000 MΩ CERTIFICATION UL Approval E323964 WIRE PROPERTIES Packaging Tube <https://katalog.we-online.de/media/images/v2/o33166v209%20Family_WR-MPC3_6620xx11122.jpg> Details see: https://katalog.we-online.de/en/em/MPC3_3_00_MALE_SINGLE_ROW_VERTICAL_HEADER_6620XX11122 Created by Yingchun,Shan 2019-11-15 2019 (C) Würth Elektronik; CONTACT-RESISTANCE: 10Ohm; DATASHEET-URL: https://katalog.we-online.com/em/datasheet/66200211122.pdf; GENDER: Male; IR1: 5A; L: 9.65mm; MATE-WITH: WR-MPC3 3.00 mm Female Single Row Receptacle; MODEL: 66200211122; MOUNT: THT; PACKAGING: Tube; PART-NUMBER: 66200211122; PCB-CABLE-PANEL: PCB; PINS: 2; PITCH: 3mm; ROWS: Single; TOL-R: max.; TYPE: Vertical; WORKING-VOLTAGE: 250V(AC)
L601 = PSFBC:XAL5030; DCR: 22mOhms; IRMS: 6A; ISAT: 8.7A; MODEL: XAL5030-332ME
Q1 = mx-misc:CRYTAL: CRYSTAL; MXCODE: CRY16M-S3225-9P10
QN901 = AlecK:NFET: 20V N Channel MOSFET - SOT23-3 - 1A https://www.diodes.com/assets/Datasheets/ds31859.pdf; MODEL: FDV305N
QP901 = AlecK:NFET: 20V N Channel MOSFET - SOT23-3 - 1A https://www.diodes.com/assets/Datasheets/ds31859.pdf; MODEL: PMV35EPER
R1-R3 R5 R6 R8 R101-R104 R201-R212 R301-R309 R601-R610 R705 R801 R802 R901-R903 = rcl:R-US_: RESISTOR, American symbol; SPICEPREFIX: R
TVS1 = PSFBC:SM15TY; MODEL: SM15T18AY
TVS2 = PSFBC:SM15TY; MODEL: SM15T6V8AY
U100 = mx-cpu:STM32F401R*T: ARM 32-bit Cortex™-M3 CPU 84 MHz maximum frequency 128 to 256 Kbytes of Flash memory 64 kbytes of SRAM 50 GPIOs 1.7 to 3.6 V application supply; MXCODE: STM32F413RGT6
U200 = PSFBC:TJA1044GT/3
U300 = PSFBC:TLE5012B; MODEL: TLE5012B
U400 = PSFBC:MS5541C; MODEL: MS5541C
U500 = Custom_library:ICM-20648: ICM-20648 Datasheet <http://www.invensense.com/wp-content/uploads/2017/07/DS-000179-ICM-20648-v1.2-TYP.pdf>
U600 = PSFBC:TPS65321-Q1

## Net classes
0 default: width 0.203 mm, drill 0.3 mm, clearance 0.152 mm
1 power: width 0.175 mm, drill 0.3 mm, clearance 0.175 mm